# EasyEDA Pro project ProProject_扫描隧道显微镜OpenSTM_2023-09-09.epro, board MCUBoard
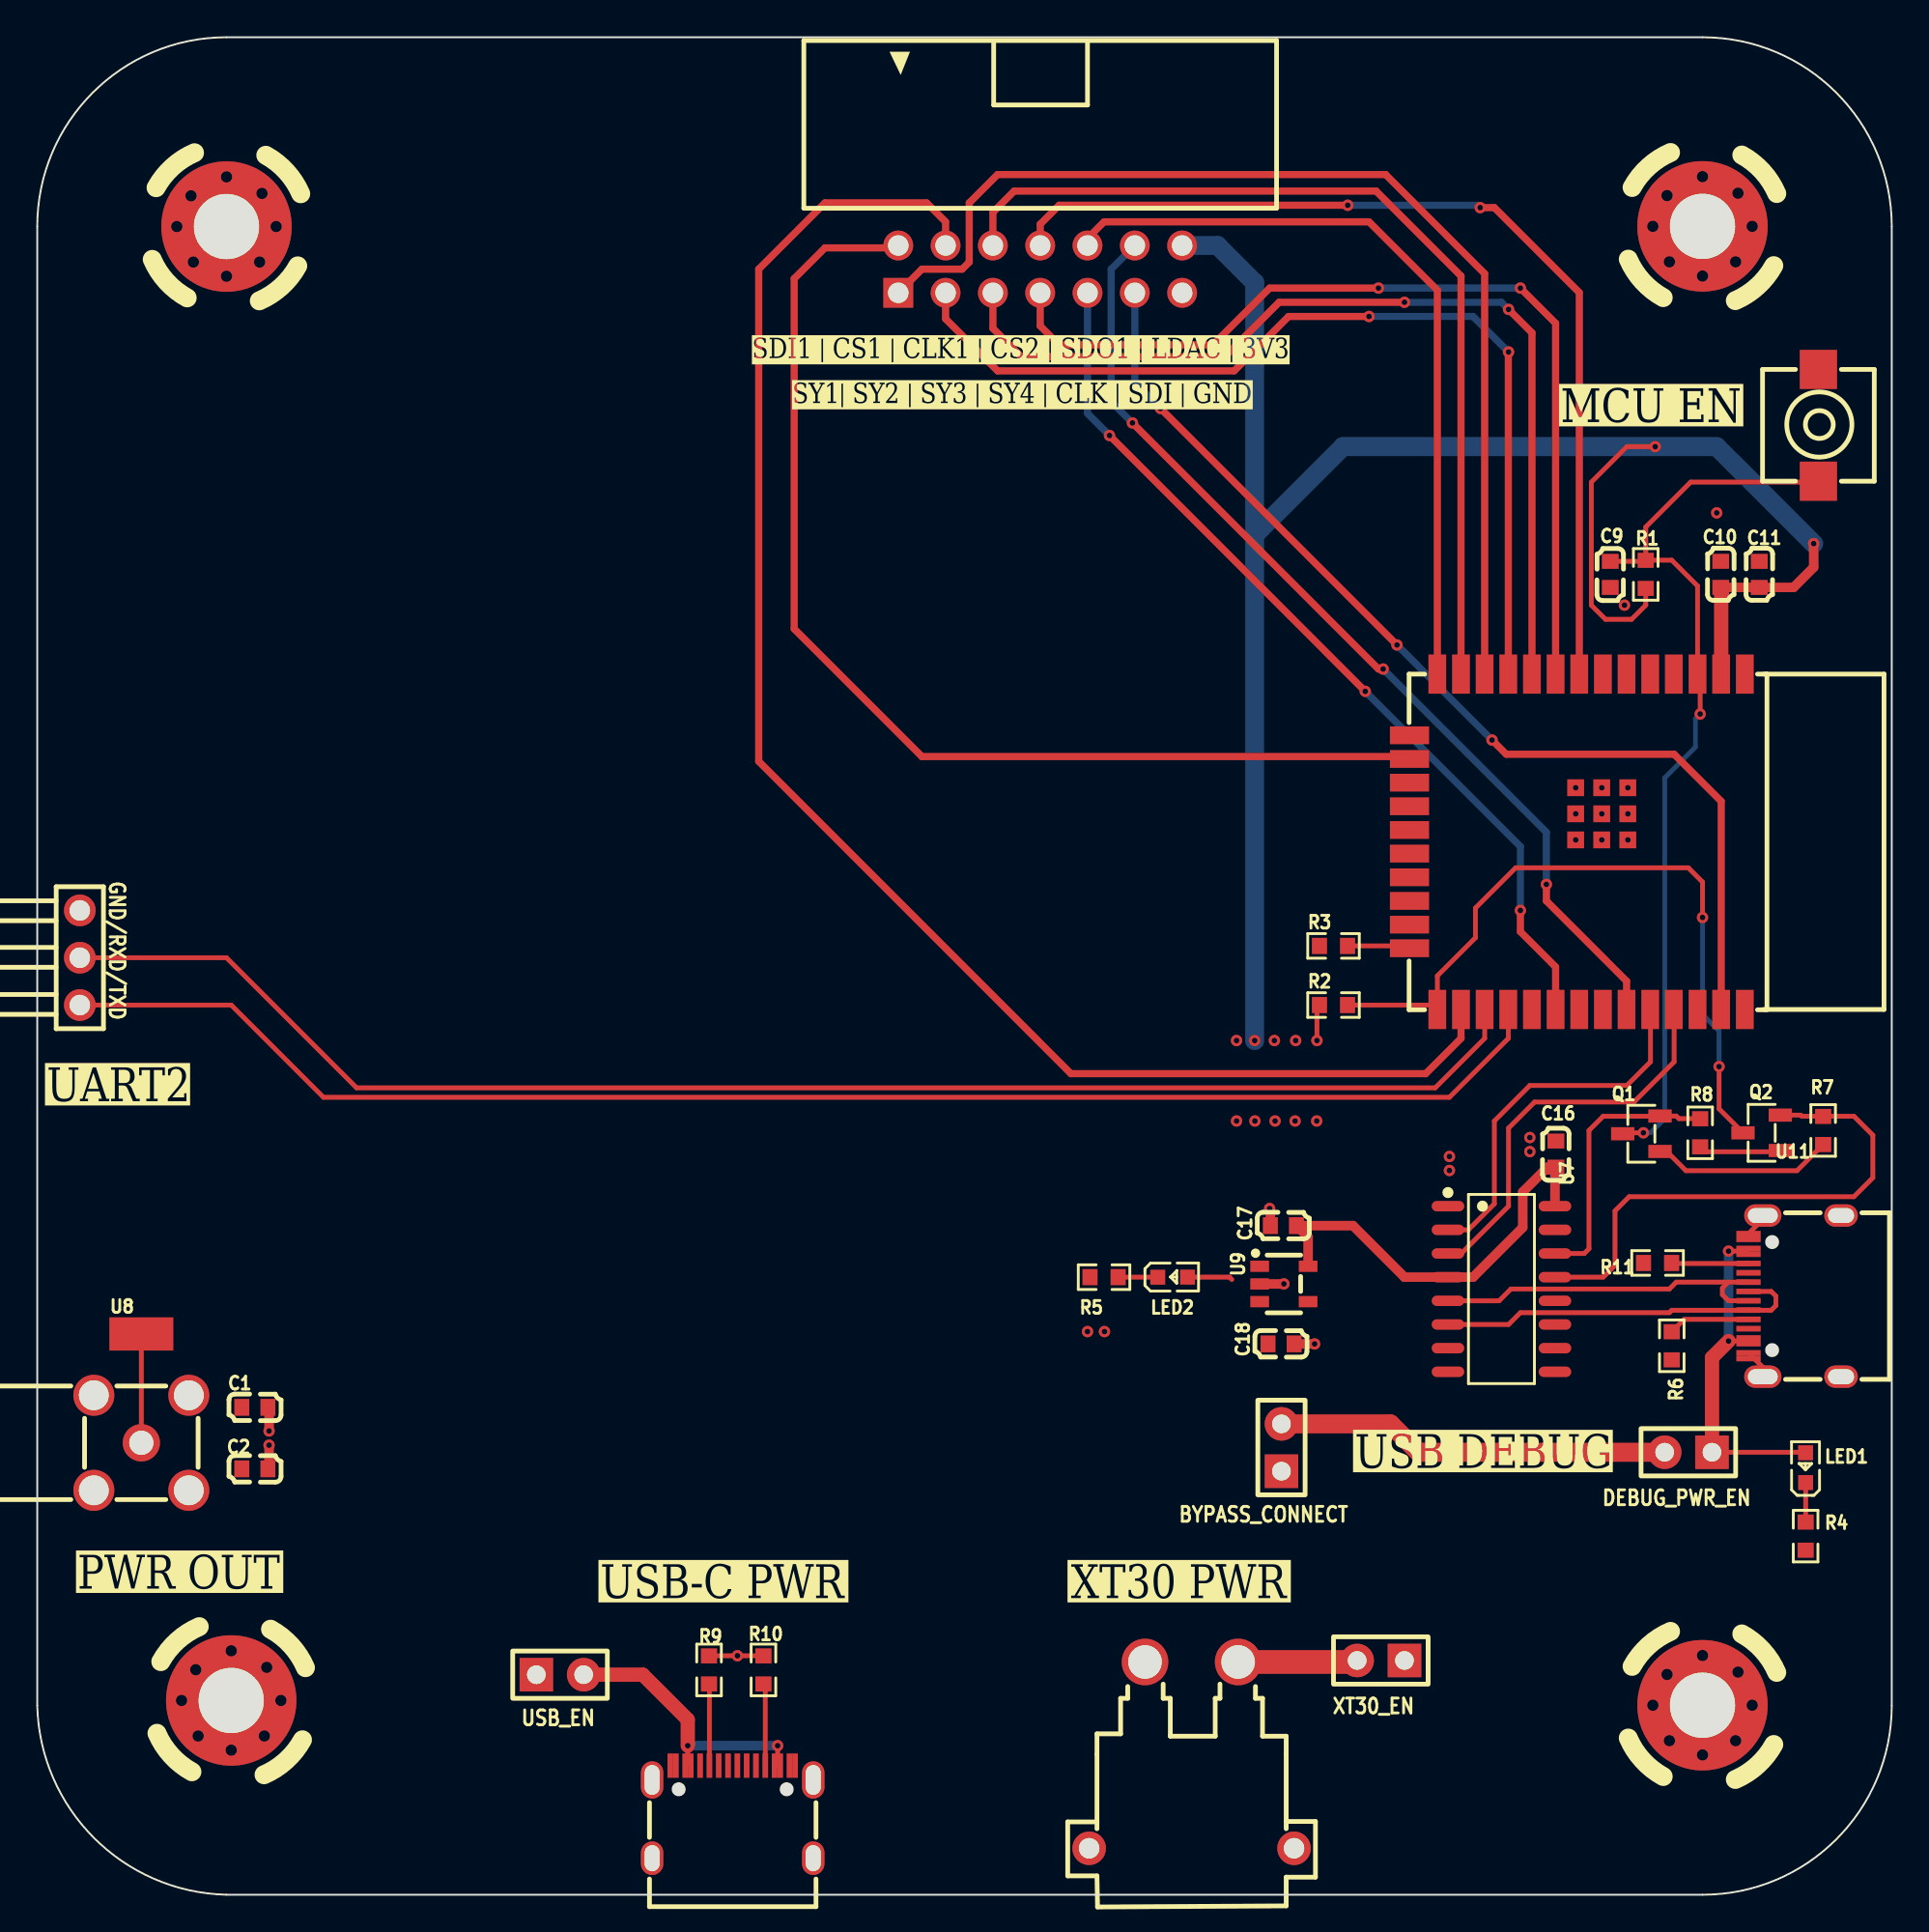
[diagram p8: board, top side]
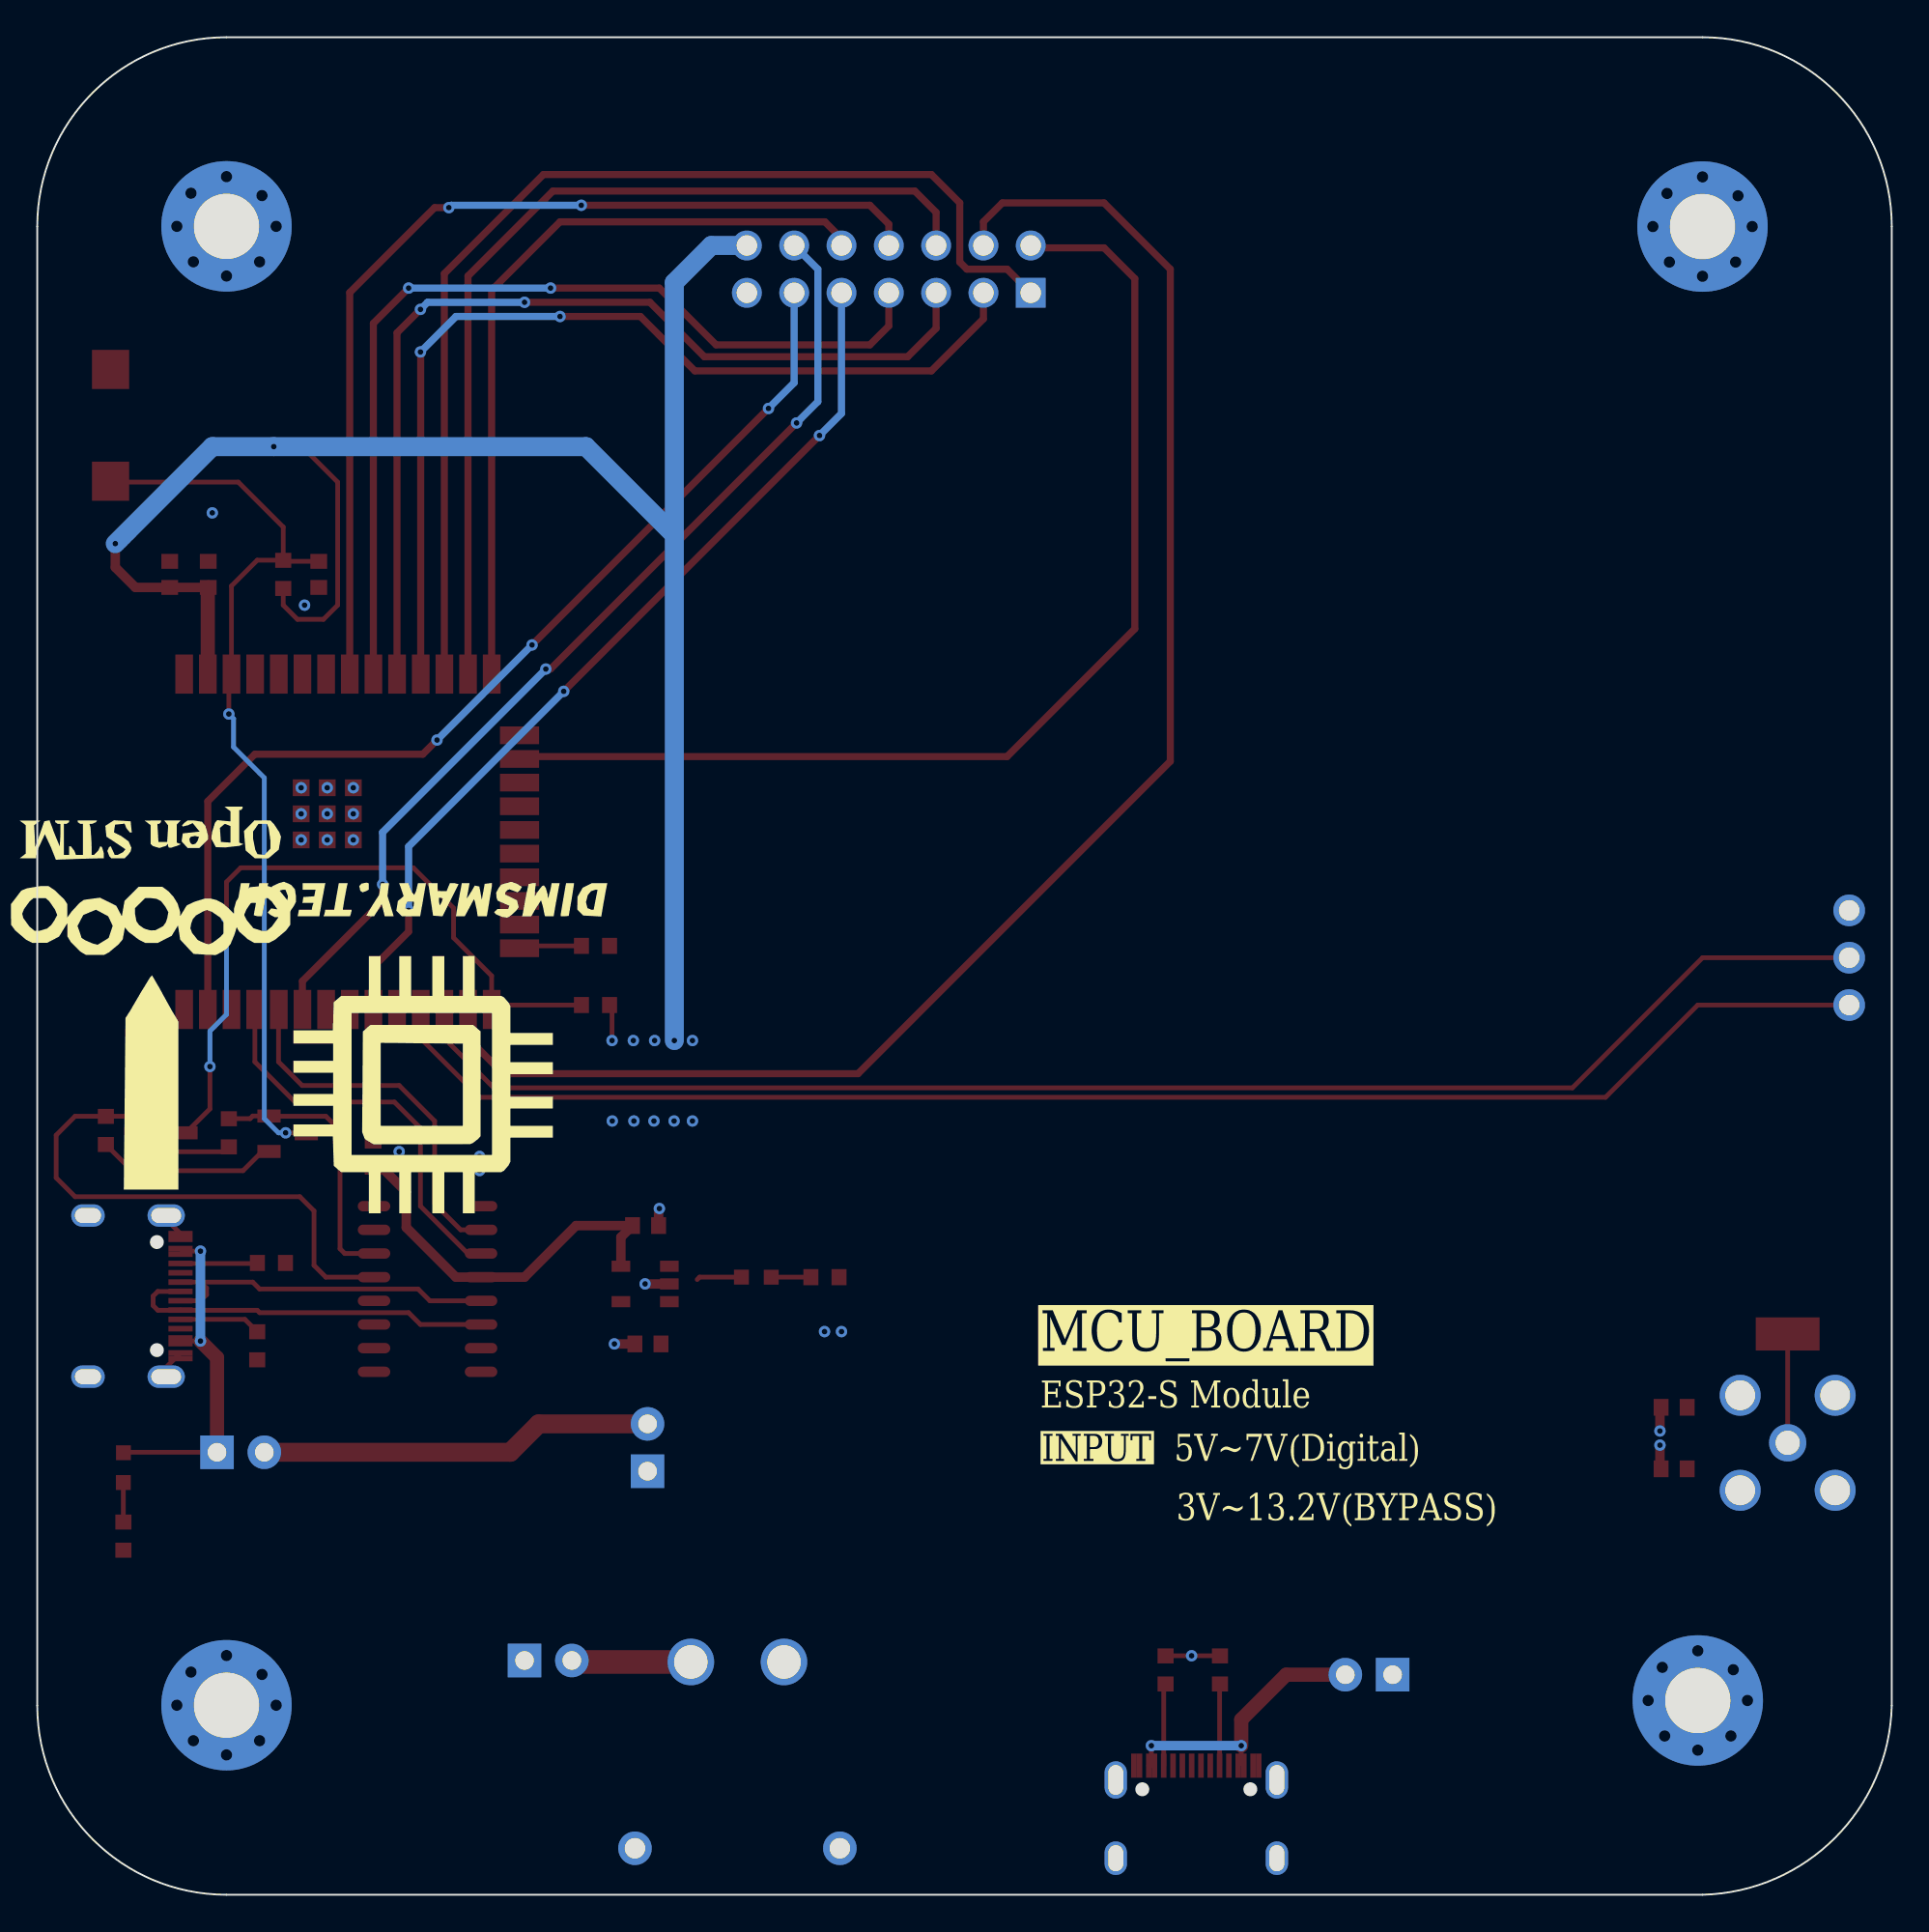
[diagram p9: board, bottom side, seen from below]

Outline 99.57 x 99.7 mm; copper layers: Top Layer, Bottom Layer. Coordinates in mm from the lower left corner of the outline.
Outline path: 0,89.54 arc(2.98,96.72) 10.16,99.7 89.41,99.7 arc(96.59,96.72) 99.57,89.54 99.57,10.16 arc(96.59,2.98) 89.41,0 10.16,0 arc(3.05,3.05) 0,10.16 0,89.54
Stack: Top Layer 0.035mm / Dielectric1 1.51mm FR4 er 4.5 / Bottom Layer 0.035mm

## Design rules (mm)
spacing safeClearance (default): track to track 0.152, other pairs 0.152 to 0.3
track width trackWidth (default): min 0.127, default 0.254, max 2.54
differential pair differentialPair (default): width min 0.127, default 0.254, max 2.54; gap min 0.152, default 0.152
via viaSize (default): diameter min 0.5, default 0.61, max 10; hole min 0.3, default 0.305, max 6

## Placement (name value [footprint] x y rotation side)
C1  100nF  [C0603]  11.68 26.16 180 top
C2  10uF  [C0603]  11.68 22.86 180 top
C9  100nF  [C0603]  84.46 70.87 90 top
C10  10uF  [C0603]  90.39 70.87 270 top
C11  100nF  [C0603]  92.46 70.87 270 top
C16  100nF  [C0603]  81.53 39.75 90 top
C17  10uF  [C0603]  66.91 35.91 0 top
C18  10uF  [C0603]  66.78 29.56 0 top
CN1  -  [CONN-TH_14P-P2.54_XKB_X9555WR-2X7-6TV01]  53.85 87.25 180 top
CN2  -  [CONN-TH_XT30PW-M]  61.98 7.49 0 top
H1  -  [HDR-TH_2P-P2.54-V-M-1]  72.14 12.57 180 top
H2  -  [HDR-TH_2P-P2.54-V-M-1]  88.65 23.75 180 top
H3  -  [HDR-TH_3P-P2.54-H-M-BW7.2-P]  2.29 50.29 270 top
H4  -  [HDR-TH_2P-P2.54-V-M-1]  28.07 11.81 0 top
H5  -  [HDR-TH_2P-P2.54-V-M-1]  66.8 24 90 top
LED1  -  [LED0603-RD_BLUE]  94.94 22.92 90 top
LED2  -  [LED0603-RD_BLUE]  60.96 33.15 0 top
NOREF  -  [Pad_e425]  10.41 10.43 0 top
NOREF#2  -  [Pad_e396]  10.16 89.54 0 top
NOREF#3  -  [Pad_e438]  89.41 10.17 0 top
NOREF#4  -  [Pad_e412]  89.41 89.55 0 top
Q1  -  [SOT-23-3_L2.9-W1.3-P1.90-LS2.4-BR]  86.12 40.85 0 top
Q2  -  [SOT-23-3_L2.9-W1.3-P1.90-LS2.4-BR]  92.58 40.89 0 top
R1  10k  [R0603]  86.36 70.87 270 top
R2  10k  [R0603]  69.6 47.75 0 top
R3  10k  [R0603]  69.6 50.93 0 top
R4  10k  [R0603]  94.94 19.25 90 top
R5  10k  [R0603]  57.28 33.15 180 top
R6  5.1kΩ  [R0603]  87.76 29.46 270 top
R7  10k  [R0603]  95.88 41.02 90 top
R8  10k  [R0603]  89.28 40.89 90 top
R9  5.1kΩ  [R0603]  36.07 12.07 90 top
R10  5.1kΩ  [R0603]  38.99 12.07 270 top
R11  5.1kΩ  [R0603]  87 33.91 0 top
RF8  -  [SMA-TH_BWSMA-KWE-Z001]  5.59 24.26 180 top
SW1  -  [KEY-SMD_2P-L6.0-W6.0-P6.00]  95.63 78.87 270 top
U7  -  [SOP-16_L10.0-W3.9-P1.27-LS6.0-BL]  78.61 32.51 270 top
U8  -  [TEST-SMD_L2.7-W1.0]  5.59 30.1 0 top
U9  -  [SOT-23-5_L3.0-W1.7-P0.95-LS2.8-BR]  66.93 32.78 180 top
U11  ESP32-WROOM-32E-N8  [WIFI-SMD_ESP32-WROOM-32E]  82.68 56.52 180 top
USBC1  -  [USB-C_SMD-TYPE-C-31-M-12]  94.36 32.13 90 top
USBC2  -  [USB-C_SMD-TYPE-C-31-M-12]  37.34 4.45 0 top

## Footprints (pads in the part's own frame, mm; a bottom-side part is the same pattern mirrored in y, then rotated)
C0603
  rect 0.8x0.9 smd: 1(-0.7,0) 2(0.7,0)
CONN-TH_14P-P2.54_XKB_X9555WR-2X7-6TV01
  rect 1.6x1.6 hole 1.1: 1(7.62,1.27)
  round 1.6 hole 1.1: 2(7.62,-1.27) 3(5.08,1.27) 4(5.08,-1.27) 5(2.54,1.27) 6(2.54,-1.27) 7(0,1.27) 8(0,-1.27) 9(-2.54,1.27) 10(-2.54,-1.27) 11(-5.08,1.27) 12(-5.08,-1.27) 13(-7.62,1.27) 14(-7.62,-1.27)
CONN-TH_XT30PW-M
  round 2.5 hole 1.8: 1(-2.5,5) 2(2.5,5)
  round 1.8 hole 1.1: 3(5.5,-5) 4(-5.5,-5)
HDR-TH_2P-P2.54-V-M-1
  rect 1.8x1.8 hole 1: 1(-1.27,0)
  round 1.8 hole 1: 2(1.27,0)
HDR-TH_3P-P2.54-H-M-BW7.2-P
  round 1.7 hole 1.1: 1(-2.54,0) 2(0,0) 3(2.54,0)
KEY-SMD_2P-L6.0-W6.0-P6.00
  rect 2.1x1.999 smd: 1(-2.999,0) 2(2.999,0)
LED0603-RD_BLUE
  rect 0.8x0.8 smd: 1(-0.8,-0.003) 2(0.8,0.003)
Pad_e396
  round 7 hole 3.5: 1(0,0)
Pad_e412
  round 7 hole 3.5: 1(0,0)
Pad_e425
  round 7 hole 3.5: 1(0,0)
Pad_e438
  round 7 hole 3.5: 1(0,0)
R0603
  rect 0.806x0.864 smd: 1(-0.753,0) 2(0.753,0)
SMA-TH_BWSMA-KWE-Z001
  round 2.2 hole 1.6: 1(-2.55,-2.55) 2(-2.55,2.55) 3(2.55,2.55) 4(2.55,-2.55)
  round 2 hole 1.3: 5(0,0)
SOP-16_L10.0-W3.9-P1.27-LS6.0-BL
  oval 0.559x1.745 smd: 1(-4.445,-2.873) 2(-3.175,-2.873) 3(-1.905,-2.873) 4(-0.635,-2.873) 5(0.635,-2.873) 6(1.905,-2.873) 7(3.175,-2.873) 8(4.445,-2.873) 9(4.445,2.873) 10(3.175,2.873) 11(1.905,2.873) 12(0.635,2.873) 13(-0.635,2.873) 14(-1.905,2.873) 15(-3.175,2.873) 16(-4.445,2.873)
SOT-23-3_L2.9-W1.3-P1.90-LS2.4-BR
  rect 1.25x0.701 smd: 1(1.001,-0.95) 2(1.001,0.95) 3(-1.001,0)
SOT-23-5_L3.0-W1.7-P0.95-LS2.8-BR
  rect 1.001x0.6 smd: 1(1.3,-0.95) 2(1.3,0) 3(1.3,0.95) 4(-1.3,0.95) 5(-1.3,-0.95)
TEST-SMD_L2.7-W1.0
  rect 3.429x1.78 smd: 1(0,0)
USB-C_SMD-TYPE-C-31-M-12
  oval 1.2x2 hole 0.8x1.6: 0(-4.325,1.716) 0(4.325,1.716)
  oval 1.2x1.8 hole 0.8x1.4: 0(-4.325,-2.484) 0(4.325,-2.484)
  rect 0.3x1.3 smd: A1(-3.35,2.484) A4(-2.55,2.484) A5(-1.25,2.484) A6(-0.25,2.484) A7(0.25,2.484) A8(1.25,2.484) A9(2.55,2.484) A12(3.35,2.484) B1(3.05,2.484) B4(2.25,2.484) B5(1.75,2.484) B6(0.75,2.484) B7(-0.75,2.484) B8(-1.75,2.484) B9(-2.25,2.484) B12(-3.05,2.484)
WIFI-SMD_ESP32-WROOM-32E
  rect 0.95x2.1 smd: 1(-9.002,-9) 2(-7.732,-9) 3(-6.463,-9) 4(-5.192,-9) 5(-3.922,-9) 6(-2.652,-9) 7(-1.383,-9) 8(-0.113,-9) 9(1.157,-9) 10(2.428,-9) 11(3.697,-9) 12(4.968,-9) 13(6.237,-9) 14(7.508,-9) 25(7.508,9) 26(6.237,9) 27(4.968,9) 28(3.697,9) 29(2.428,9) 30(1.157,9) 31(-0.113,9) 32(-1.383,9) 33(-2.652,9) 34(-3.922,9) 35(-5.192,9) 36(-6.463,9) 37(-7.732,9) 38(-9.002,9)
  rect 2.1x0.95 smd: 15(9.002,-5.715) 16(9.002,-4.445) 17(9.002,-3.175) 18(9.002,-1.905) 19(9.002,-0.635) 20(9.002,0.635) 21(9.002,1.905) 22(9.002,3.175) 23(9.002,4.445) 24(9.002,5.715)
  rect 0.9x0.9 smd: 39(-2.721,-0.1) 39(-2.721,-1.5) 39(-2.721,-2.9) 39(-1.321,-0.1) 39(-1.321,-1.5) 39(-1.321,-2.9) 39(0.079,-0.1) 39(0.079,-1.5) 39(0.079,-2.9)

## Nets
As in the schematic, except:
GND: C1.1 C2.1 C9.1 C10.1 C11.1 C16.2 C17.1 C18.2 CN1.13 CN2.1 CN2.3 CN2.4 H3.1 NOREF.1 NOREF#2.1 NOREF#3.1 NOREF#4.1 R3.1 R4.1 R5.2 R6.2 R9.2 R10.1 R11.1 RF8.1 RF8.2 RF8.3 RF8.4 SW1.1 U7.1 U9.2 U11.1 U11.15 U11.38 U11.39 USBC1.0 USBC1.A1 USBC1.A12 USBC1.B1 USBC1.B12 USBC2.0 USBC2.A1 USBC2.A12 USBC2.B1 USBC2.B12

Pads without a net: U7 7 8 9 10 11 12 15; U9 4; U11 4 5 6 7 17 18 19 20 21 22 23 29 31 32 36; USBC1 A8 B8; USBC2 A6 A7 A8 B6 B7 B8

## Via types
v1: diameter 0.61, hole 0.305, Top Layer to Bottom Layer, 60 vias
v2: diameter 1.219, hole 0.61, Top Layer to Bottom Layer, 32 vias

## Routing (per net, layer and track width the routed paths; a pad name or vN(x,y) marks a point on that pad's centre or on a via; arc(x,y) is an arc through that point)
3V3: length 131.2
  Top Layer w0.254: v1(68.71,45.85) 68.71,47.62 R2.1 ; v1(86.87,77.72) 85.34,77.72 83.44,75.82 83.44,69.22 84.2,68.45 85.6,68.45 86.36,69.22 R1.2
  Top Layer w0.508: U9.5 68.23,35.29 C17.2 70.64,35.91 73.41,33.15 U7.4 77.09,33.15 79.76,35.81 79.76,37.72 81.09,39.05 C16.1 81.49,39 U7.16 ; C10.2 94.3,70.17 95.38,71.25 v1(95.38,72.52)
  Top Layer w0.762: C10.2 90.41,70.14 90.41,65.64
  Bottom Layer w1.016: v1(65.36,45.85) 65.36,72.98 ; 65.36,72.98 70.1,77.72 v1(86.87,77.72) 90.17,77.72 v1(95.38,72.52) ; 65.36,72.98 65.36,86.53 63.37,88.52 61.47,88.52
  vias: v1(64.39,45.85) v1(64.39,41.53) v1(65.38,41.53) v1(66.42,45.85) v1(66.46,41.53) v1(67.56,45.85) v1(67.53,41.53) v1(68.69,41.53)
+5V: length 23.6
  Top Layer w0.254: 61.76,33.15 64.01,33.15 64.13,33.02
  Top Layer w1.016: H2.2 74.17,23.75 72.64,25.27 H5.2
+5V_BYPASS: length 5.8
  Top Layer w0.254: RF8.5 U8.1
GND: length 11.7
  Top Layer w0.254: R10.1 38.98,12.83 v1(37.59,12.83) 36.08,12.83 R9.2 ; USBC1.0 92.65,28.31 USBC1.B12 ; USBC1.A12 92.65,36.25 USBC1.0
  Top Layer w0.508: C2.1 12.45,22.92 v1(12.45,24.13) ; v1(66.17,36.83) 66.21,36.79 C17.1 ; C1.1 12.45,26.1 v1(12.45,24.89) ; U9.2 66.93,32.78 v1(66.93,32.79) ; C18.2 v1(68.58,29.56)
  vias: v1(56.39,30.23) v1(57.3,30.23) v1(75.82,39.62) v1(75.82,38.87) v1(80.14,40.64) v1(80.14,39.89) v1(82.6,59.42) v1(82.6,58.02) v1(82.6,56.62) v1(84,59.42) v1(84,58.02) v1(84,56.62) v1(85.22,69.22) v1(85.4,59.42) v1(85.4,58.02) v1(85.4,56.62) v1(90.17,74.17) v2(7.49,89.54) v2(7.75,10.43) v2(8.25,91.19) v2(8.38,87.63) v2(8.51,12.08) v2(8.64,8.52) v2(10.16,92.2) v2(10.16,86.87) v2(10.41,13.09) v2(10.41,7.76) v2(11.94,87.63) v2(12.06,91.31) v2(12.19,8.52) v2(12.32,12.2) v2(12.83,89.54) v2(13.08,10.43) v2(86.74,89.55) v2(86.74,10.17) v2(87.5,91.2) v2(87.5,11.82) v2(87.63,87.64) v2(87.63,8.27) v2(89.41,92.21) v2(89.41,86.88) v2(89.41,12.84) v2(89.41,7.51) v2(91.19,87.64) v2(91.19,8.27) v2(91.31,91.33) v2(91.31,11.95) v2(92.07,89.55) v2(92.07,10.17)
CS1: length 86.7
  Top Layer w0.381: CN1.4 48.77,89.79 47.75,90.81 42.29,90.81 38.74,87.25 38.74,60.83 55.5,44.07 74.55,44.07 76.44,45.96 76.44,47.64
CS2: length 52.8
  Top Layer w0.381: CN1.8 53.85,89.66 54.86,90.68 v1(70.36,90.68) ; v1(77.47,90.55) 78.23,90.55 82.79,85.99 82.79,65.64
  Bottom Layer w0.381: v1(77.47,90.55) 77.34,90.68 v1(70.36,90.68)
DTR: length 28.7
  Top Layer w0.254: Q2.2 94.68,41.84 94.74,41.78 95.88,41.78 R7.2 95.89,41.78 97.54,41.78 98.55,40.77 98.55,38.48 97.54,37.47 85.47,37.47 84.71,36.7 84.71,33.78 84.07,33.15 U7.13
EN: length 49.4
  Top Layer w0.254: R1.1 86.31,71.57 C9.2 ; R1.1 86.37,71.63 87.76,71.63 89.14,70.24 89.14,65.64 89.28,65.5 v1(89.28,63.37) ; R1.1 86.36,73.41 88.77,75.82 95.58,75.82 SW1.2 ; Q1.3 85.17,40.89 v1(86.23,40.89)
  Bottom Layer w0.254: v1(86.23,40.89) 86.61,40.89 87.38,41.66 87.38,59.94 89.03,61.6 89.03,63.12 v1(89.28,63.37)
GPIO0: length 38.8
  Top Layer w0.254: v1(90.3,44.45) 90.3,42.18 Q2.3 ; v1(89.41,52.45) 89.41,54.36 88.65,55.12 79.38,55.12 77.22,52.96 77.22,51.36 75.17,49.32 75.17,47.64 75.06,47.75 R2.2
  Bottom Layer w0.254: v1(89.41,52.45) 89.41,47.24 90.3,46.36 v1(90.3,44.45)
HSPI_MISO: length 41.5
  Top Layer w0.381: CN1.10 56.39,88.9 57.28,89.79 71.5,89.79 75.17,86.12 75.17,65.64
HSPI_MOSI: length 61
  Top Layer w0.381: 73.67,61.09 47.5,61.09 40.64,67.95 40.64,86.74 42.29,88.39 46.1,88.39 CN1.2
HSPI_SCLK: length 50.5
  Top Layer w0.381: 76.44,65.64 76.44,86.88 71.88,91.44 52.45,91.44 51.31,90.3 51.31,88.52
LDAC_MCU: length 53
  Top Layer w0.381: v1(81.03,54.23) 81.03,53.34 85.33,49.03 85.33,47.64 ; v1(72.26,65.79) 72.01,65.79 v1(58.8,78.99)
  Bottom Layer w0.381: 58.93,88.52 57.66,87.25 57.66,80.14 v1(58.8,78.99) ; v1(81.03,54.23) 81.03,57.02 v1(72.26,65.79)
RTS: length 14.6
  Top Layer w0.254: R8.2 89.27,41.66 88.14,41.66 88,41.8 Q1.2 87.11,41.78 84.07,41.78 83.31,41.02 83.31,34.67 83.06,34.42 U7.14
RXD0: length 20.2
  Top Layer w0.254: 86.6,47.64 86.61,47.63 86.61,44.7 85.34,43.43 80.14,43.43 78.23,41.53 78.23,37.08 76.84,35.69 U7.2
RXD2: length 81.1
  Top Layer w0.254: 77.71,47.64 77.71,45.96 75.06,43.31 17.14,43.31 10.16,50.29 H3.2
SYNC1: length 59.5
  Top Layer w0.381: 77.71,65.64 77.71,87.01 72.39,92.33 51.56,92.33 50.04,90.81 50.04,87.63 49.66,87.25 47.5,87.25 CN1.1
SYNC2: length 51.9
  Top Layer w0.381: CN1.3 48.77,84.58 51.56,81.79 64.26,81.79 67.18,84.71 v1(71.5,84.71) ; v1(78.99,82.8) 78.98,82.79 78.98,65.64
  Bottom Layer w0.381: v1(78.99,82.8) 77.09,84.71 v1(71.5,84.71)
SYNC3: length 51.6
  Top Layer w0.381: v1(78.99,85.09) 80.25,83.83 80.25,65.64 ; 51.31,85.98 51.31,84.07 52.83,82.55 63.75,82.55 66.68,85.47 v1(73.41,85.47)
  Bottom Layer w0.381: v1(73.41,85.47) 78.61,85.47 v1(78.99,85.09)
SYNC4: length 50.6
  Top Layer w0.381: v1(72.01,86.23) 66.17,86.23 63.12,83.19 54.86,83.19 53.85,84.2 CN1.7 ; 81.52,65.64 81.52,84.34 v1(79.63,86.23)
  Bottom Layer w0.381: v1(79.63,86.23) v1(72.01,86.23)
TXD0: length 21.8
  Top Layer w0.254: 87.87,47.64 87.88,47.63 87.88,44.7 85.72,42.55 80.39,42.55 78.99,41.15 78.99,36.96 76.45,34.42 U7.3
TXD2: length 81.7
  Top Layer w0.254: H3.3 10.41,47.75 15.37,42.8 75.82,42.8 78.98,45.96 78.98,47.64
TYPEC_VCC: length 15.4
  Top Layer w0.254: USBC2.A4 34.93,7.07 v1(34.93,8) ; USBC2.B4 USBC2.A9 39.75,7.07 v1(39.75,8)
  Top Layer w0.762: H4.2 32.51,11.81 34.93,9.4 v1(34.93,8)
  Bottom Layer w0.508: v1(39.75,8) v1(34.93,8)
USB_N: length 20.1
  Top Layer w0.254: USBC1.A7 93.09,32.38 93.34,32.13 93.34,31.62 93.09,31.37 91.89,31.37 USBC1.B7 91.87,31.37 87.76,31.37 87.63,31.24 79.63,31.24 78.99,30.61 U7.6
USB_P: length 18.9
  Top Layer w0.254: 90.77,32.88 88,32.88 87.63,32.51 79.12,32.51 78.49,31.88 U7.5 ; USBC1.A6 90.8,31.88 90.48,32.21 90.48,32.56 90.79,32.88 USBC1.B6
USB_VCC: length 17.7
  Top Layer w0.254: USBC1.B4 91.71,34.54 v1(90.81,34.54) ; 90.68,23.75 94.91,23.75 LED1.2 ; USBC1.A4 91.74,29.72 v1(90.81,29.72)
  Top Layer w0.762: v1(90.81,29.72) 89.92,28.83 H2.1
  Bottom Layer w0.508: v1(90.81,34.54) v1(90.81,29.72)
VSPI_MOSI: length 56.7
  Top Layer w0.381: 90.41,47.64 90.41,58.69 87.88,61.21 78.87,61.21 v1(78.1,61.98) ; v1(73,67.08) v1(60.31,79.77)
  Bottom Layer w0.381: 58.93,85.98 58.93,81.15 v1(60.31,79.77) ; v1(78.1,61.98) v1(73,67.08)
VSPI_SCLK: length 48.7
  Top Layer w0.381: 81.52,47.64 81.52,49.8 79.63,51.69 v1(79.63,52.83) ; v1(71.3,64.59) v1(57.57,78.32)
  Bottom Layer w0.381: v1(71.3,64.59) 79.63,56.26 v1(79.63,52.83) ; v1(57.57,78.32) 56.39,79.5 CN1.9
$1N26140: length 9.8
  Top Layer w0.254: R7.1 94.48,38.86 88.52,38.86 87.49,39.9 Q1.1
$1N26141: length 4.4
  Top Layer w0.254: 93.58,39.94 93.52,39.88 89.54,39.88 R8.1
$1N50028: length 2.1
  Top Layer w0.254: R4.2 94.95,20 LED1.1
$1N50054: length 2.1
  Top Layer w0.254: LED2.1 60.16,33.15 R5.1
$1N55680: length 6.4
  Top Layer w1.27: CN2.2 70.79,12.49 H1.2
$1N60322: length 4.4
  Top Layer w0.254: USBC2.B5 39.09,11.21 R10.2
$1N60417: length 4.4
  Top Layer w0.254: USBC2.A5 36.09,11.29 R9.1
$1N61298: length 4.1
  Top Layer w0.254: USBC1.B5 87.78,33.88 R11.2
$1N61403: length 4.4
  Top Layer w0.254: USBC1.A5 88.42,30.88 R6.1
$1N65378: length 3.3
  Top Layer w0.254: R3.2 73.67,50.93

## Copper pours and planes (outline as drawn; the poured copper is in the pictures)
3V3 on Top Layer: 63.63,42.29 69.72,42.29 69.72,35.18 63.63,35.18
3V3 on Bottom Layer: 63.63,46.36 69.72,46.36 69.72,40.39 63.63,40.39
+5V on Top Layer: 69.98,24.38 69.98,34.8 60.71,34.8 60.71,27.31 63.63,24.38
+5V_BYPASS on Top Layer: 4.57,28.32 13.97,28.32 15.62,26.67 15.62,18.03 18.54,15.11 60.96,15.11 63.75,17.91 63.75,23.37 64.52,24.13 68.71,24.13 69.98,22.86 69.98,17.4 72.39,14.99 76.71,14.99 77.98,13.72 77.98,9.65 76.71,8.38 45.85,8.38 44.2,10.03 19.62,10.03 12.26,17.4 4.57,17.4
GND on Top Layer: -8.64,112.4 112.9,112.4 112.9,-9.65 -8.64,-9.65
GND on Bottom Layer: -12.32,118.36 117.35,118.36 117.35,-12.7 -12.32,-12.7

## Text on the board
Bottom Silkscreen Layer: 3V~13.2V(BYPASS) | 5V~7V(Digital) | INPUT | ESP32-S Module | MCU_BOARD
Top Silkscreen Layer: USB_EN | BYPASS_CONNECT | XT30_EN | DEBUG_PWR_EN | GND/RXD/TXD | SDI1 | CS1 | CLK1 | CS2 | SDO1 | LDAC | 3V3 | SY1| SY2 | SY3 | SY4 | CLK | SDI | GND | USB-C PWR | XT30 PWR | PWR OUT | UART2 | MCU EN | USB DEBUG
